# EAGLE design CoilX (EAGLE 7.2.0)
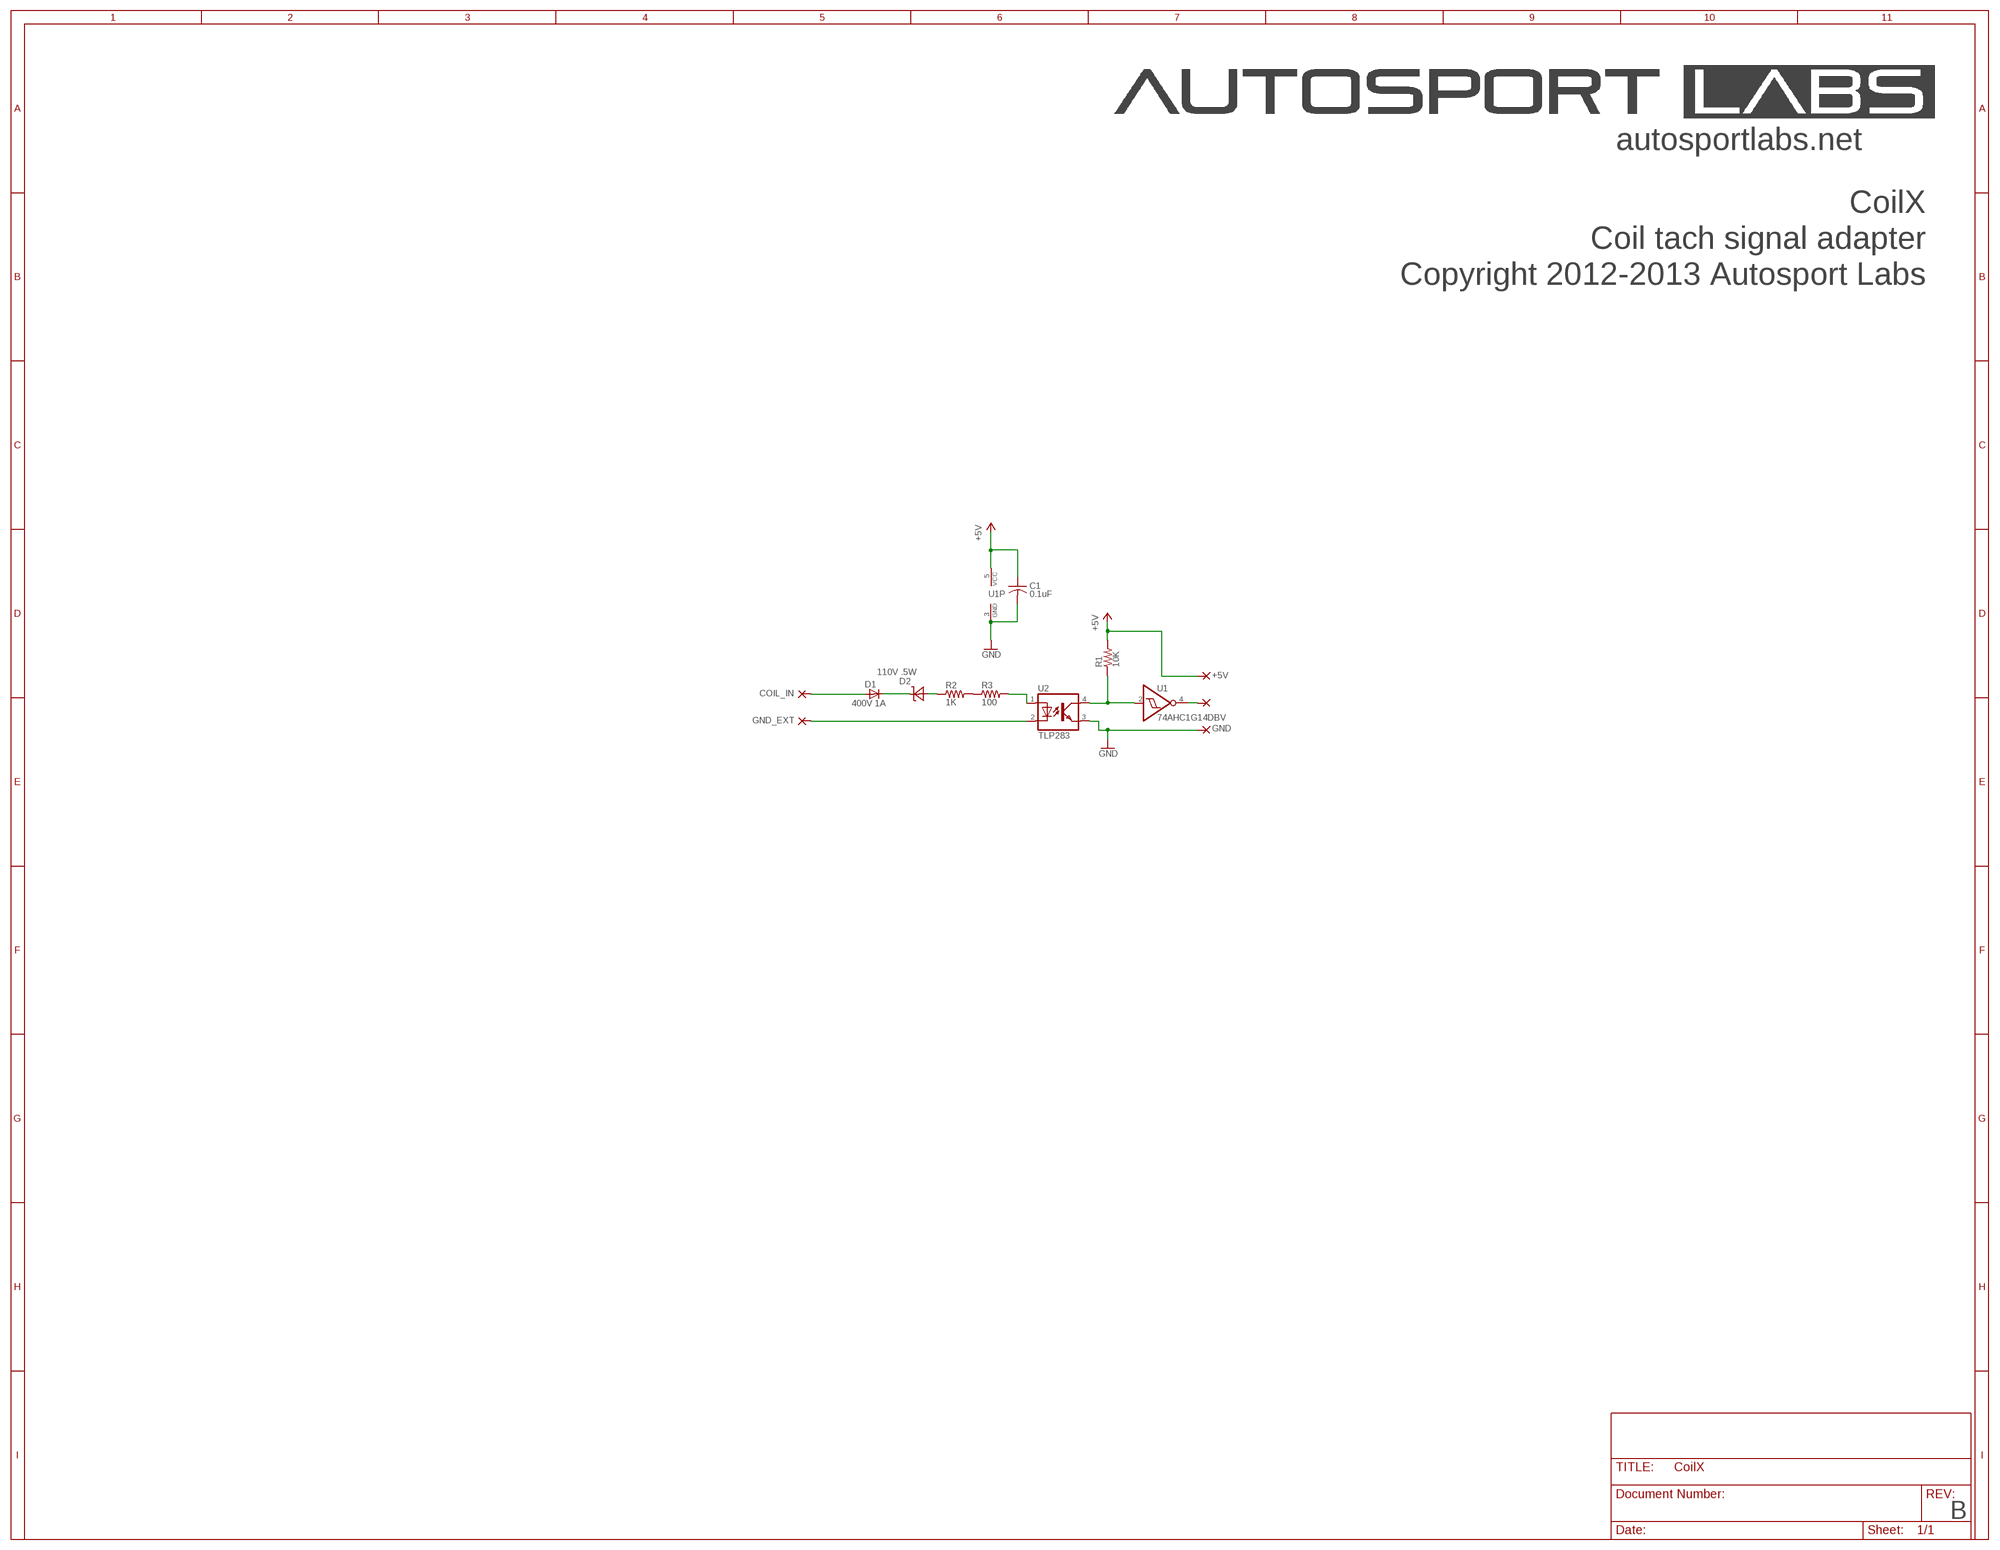
[diagram p0: schematic, sheet 1]

## Parts
+5V  WIREPAD3,17/1,2  [3,17/1,2]
C1  0.1uF  C-USC0603  [C0603]
COIL  WIREPAD3,17/1,2  [3,17/1,2]
D1  400V 1A  DIODE1  [SMA]
D2  110V .5W  ZENER2  [SOD123]
GND  WIREPAD3,17/1,2  [3,17/1,2]
GND_EXT  WIREPAD3,17/1,2  [3,17/1,2]
OUT  WIREPAD3,17/1,2  [3,17/1,2]
R1  10K  R-US_R0603  [R0603]
R2  1K  R-US_R1206  [R1206]
R3  100  R-US_R0603  [R0603]
U1  74AHC1G14DBV  [SOT23-5]
U2  TLP283  [MINI-FLAT-4]

## Nets
+5V: +5V.1(P) C1.1 R1.2 U1.5(VCC)
COIL_IN: COIL.1(P) D1.A
FREQ_1_IN_LOGIC: R2.2 R3.1
GND: C1.2 GND.1(P) U1.3(GND) U2.3(EMIT)
GND_EXT: GND_EXT.1(P) U2.2(C)
N$1: D2.A R2.1
N$2: OUT.1(P) U1.4(O)
N$3: R3.2 U2.1(A)
N$5: D1.C D2.C
OPTO_TACH_OUT: R1.1 U1.2(I) U2.4(COL)

## Notes on the sheet
- autosportlabs.net
- CoilX
- Coil tach signal adapter
- Copyright 2012-2013 Autosport Labs
- B

## Library data of the parts
+5V COIL GND GND_EXT OUT = wirepad:WIREPAD: Wire PAD connect wire on PCB
C1 = rcl:C-US: CAPACITOR, American symbol
D1 = smt_diodes:DIODE
D2 = smt_diodes:ZENER
R1-R3 = rcl:R-US_: RESISTOR, American symbol
U1 = 74xx-little-de:74*1G14: Single Schmitt-Trigger Inverter Gate
U2 = optocoupler:TLP283: TOSHIBA PHOTOCOUPLER GaAs IRED & PHOTO-TRANSISTOR Source: http://www.semicon.toshiba.co.jp/td/en/Opto/Photocoupler/en_20050928_TLP283_datasheet.pdf

## Board
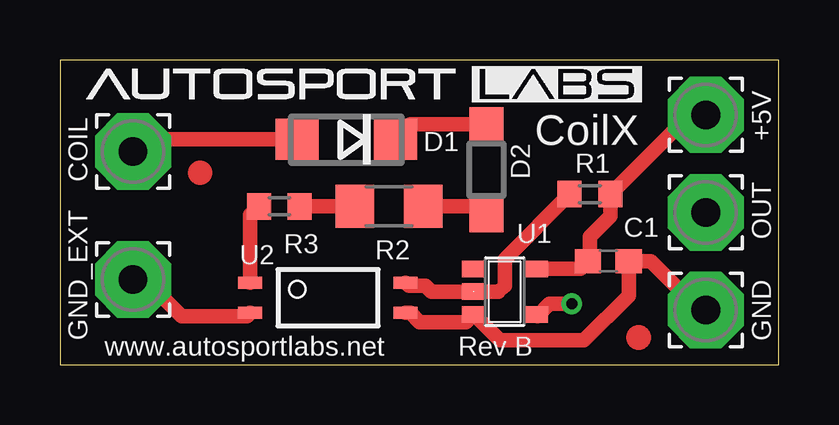
[diagram p1: board, top side]
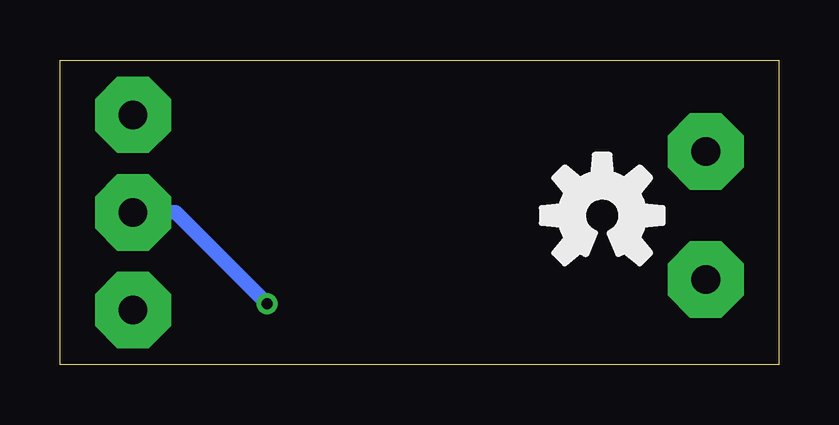
[diagram p2: board, bottom side, seen from below]

Size 29.97 x 12.7 mm. Coordinates in mm from the lower left corner, seen from the top.
Outline: 0,0 29.97,0 29.97,12.7 0,12.7 0,0
Copper layers (1*16): Top 0.035mm / dielectric 1.5mm / Bottom 0.035mm
Design rules "default *": minimum track width 10mil, minimum drill 18mil, track to track 8mil, track to pad 8mil, pad to pad 8mil, via to via 8mil, smd to smd 8mil, copper to edge 20mil, drill to drill 8mil, minimum pad ring 10mil, minimum via ring 8mil, stop-mask expansion 4mil, vias tented up to drill 20mil, thermal gap 10mil

### Footprints (pad centres in the part's own frame; a part is rotated, then mirrored left to right if it is on the bottom)
3,17/1,2 = drill 1.194 pad 3.175 octagon: 1 0,0
C0603 = smd 1.1 x 1: 1 -0.85,0; 2 0.85,0
SMA = smd 1.8 x 1.7: A 2.05,0; C -2.05,0
SOD123 = smd 1.4 x 1.4: A 1.9,0; C -1.9,0
R0603 = smd 1 x 1.1: 1 -0.85,0; 2 0.85,0
R1206 = smd 1.6 x 1.803: 1 -1.422,0; 2 1.422,0
SOT23-5 = smd 0.69 x 0.99: 1 -0.95,-1.29; 2 0,-1.29; 3 0.95,-1.29; 4 0.95,1.3; 5 -0.95,1.3
MINI-FLAT-4 = smd 1 x 0.5: 1 -3.24,0.635; 2 -3.24,-0.635; 3 3.24,-0.635; 4 3.24,0.635

### Placement (x,y rotation side)
+5V  26.92,10.41 0 top
C1  22.86,4.32 0 top
COIL  3.05,8.89 0 top
D1  11.94,9.4 180 top
D2  17.78,8.13 270 top
GND  26.92,2.29 0 top
GND_EXT  3.05,3.56 0 top
OUT  26.92,6.35 0 top
R1  22.1,7.11 0 top
R2  13.72,6.6 180 top
R3  9.14,6.6 180 top
U1  18.54,3.05 270 top
U2  11.18,2.79 0 top

### Tracks (layer width: path | path; a pad name or v marks a point on that pad's centre or on a via)
+5V
  Top 0.61: U1.5 21.69,4 C1.1 22.1,4.41 22.1,5.33 22.95,6.18 R1.2 26.25,10.41 +5V.1
COIL_IN
  Top 0.61: COIL.1 3.56,9.4 D1.A
FREQ_1_IN_LOGIC
  Top 0.61: R3.1 R2.2
GND
  Top 0.61: U2.3 14.61,2.16 14.99,1.78 16.93,1.78 U1.3 18.33,1.02 21.84,1.02 23.71,2.88 C1.2 24.64,4.32 26.92,2.03 GND.1
GND_EXT
  Top 0.61: U2.2 7.81,2.03 5.08,2.03 3.56,3.56 GND_EXT.1
N$1
  Top 0.61: D2.A 17.4,6.6 R2.1
N$2  (via drill 0.46)
  Top 0.61: U1.4 19.91,2.03 20.42,2.54 v21.34,2.54
  Bottom 0.61: OUT.1 26.42,6.35 25.65,6.35 25.15,6.35 v21.34,2.54
N$3
  Top 0.61: R3.2 7.94,6.25 U2.1
N$5
  Top 0.61: D1.C 14.62,10.03 D2.C
OPTO_TACH_OUT
  Top 0.61: R1.1 18.54,4.41 18.54,3.3 18.29,3.05 U1.2 15.49,3.05 15.24,3.3 14.54,3.3 U2.4
(copper drawn outside any net)
  shapes: Top circle x2

### Text on the board
tPlace: CoilX | www.autosportlabs.net | Rev B